# Altium schematic sheet Connector_GTX.SchDoc
size A3
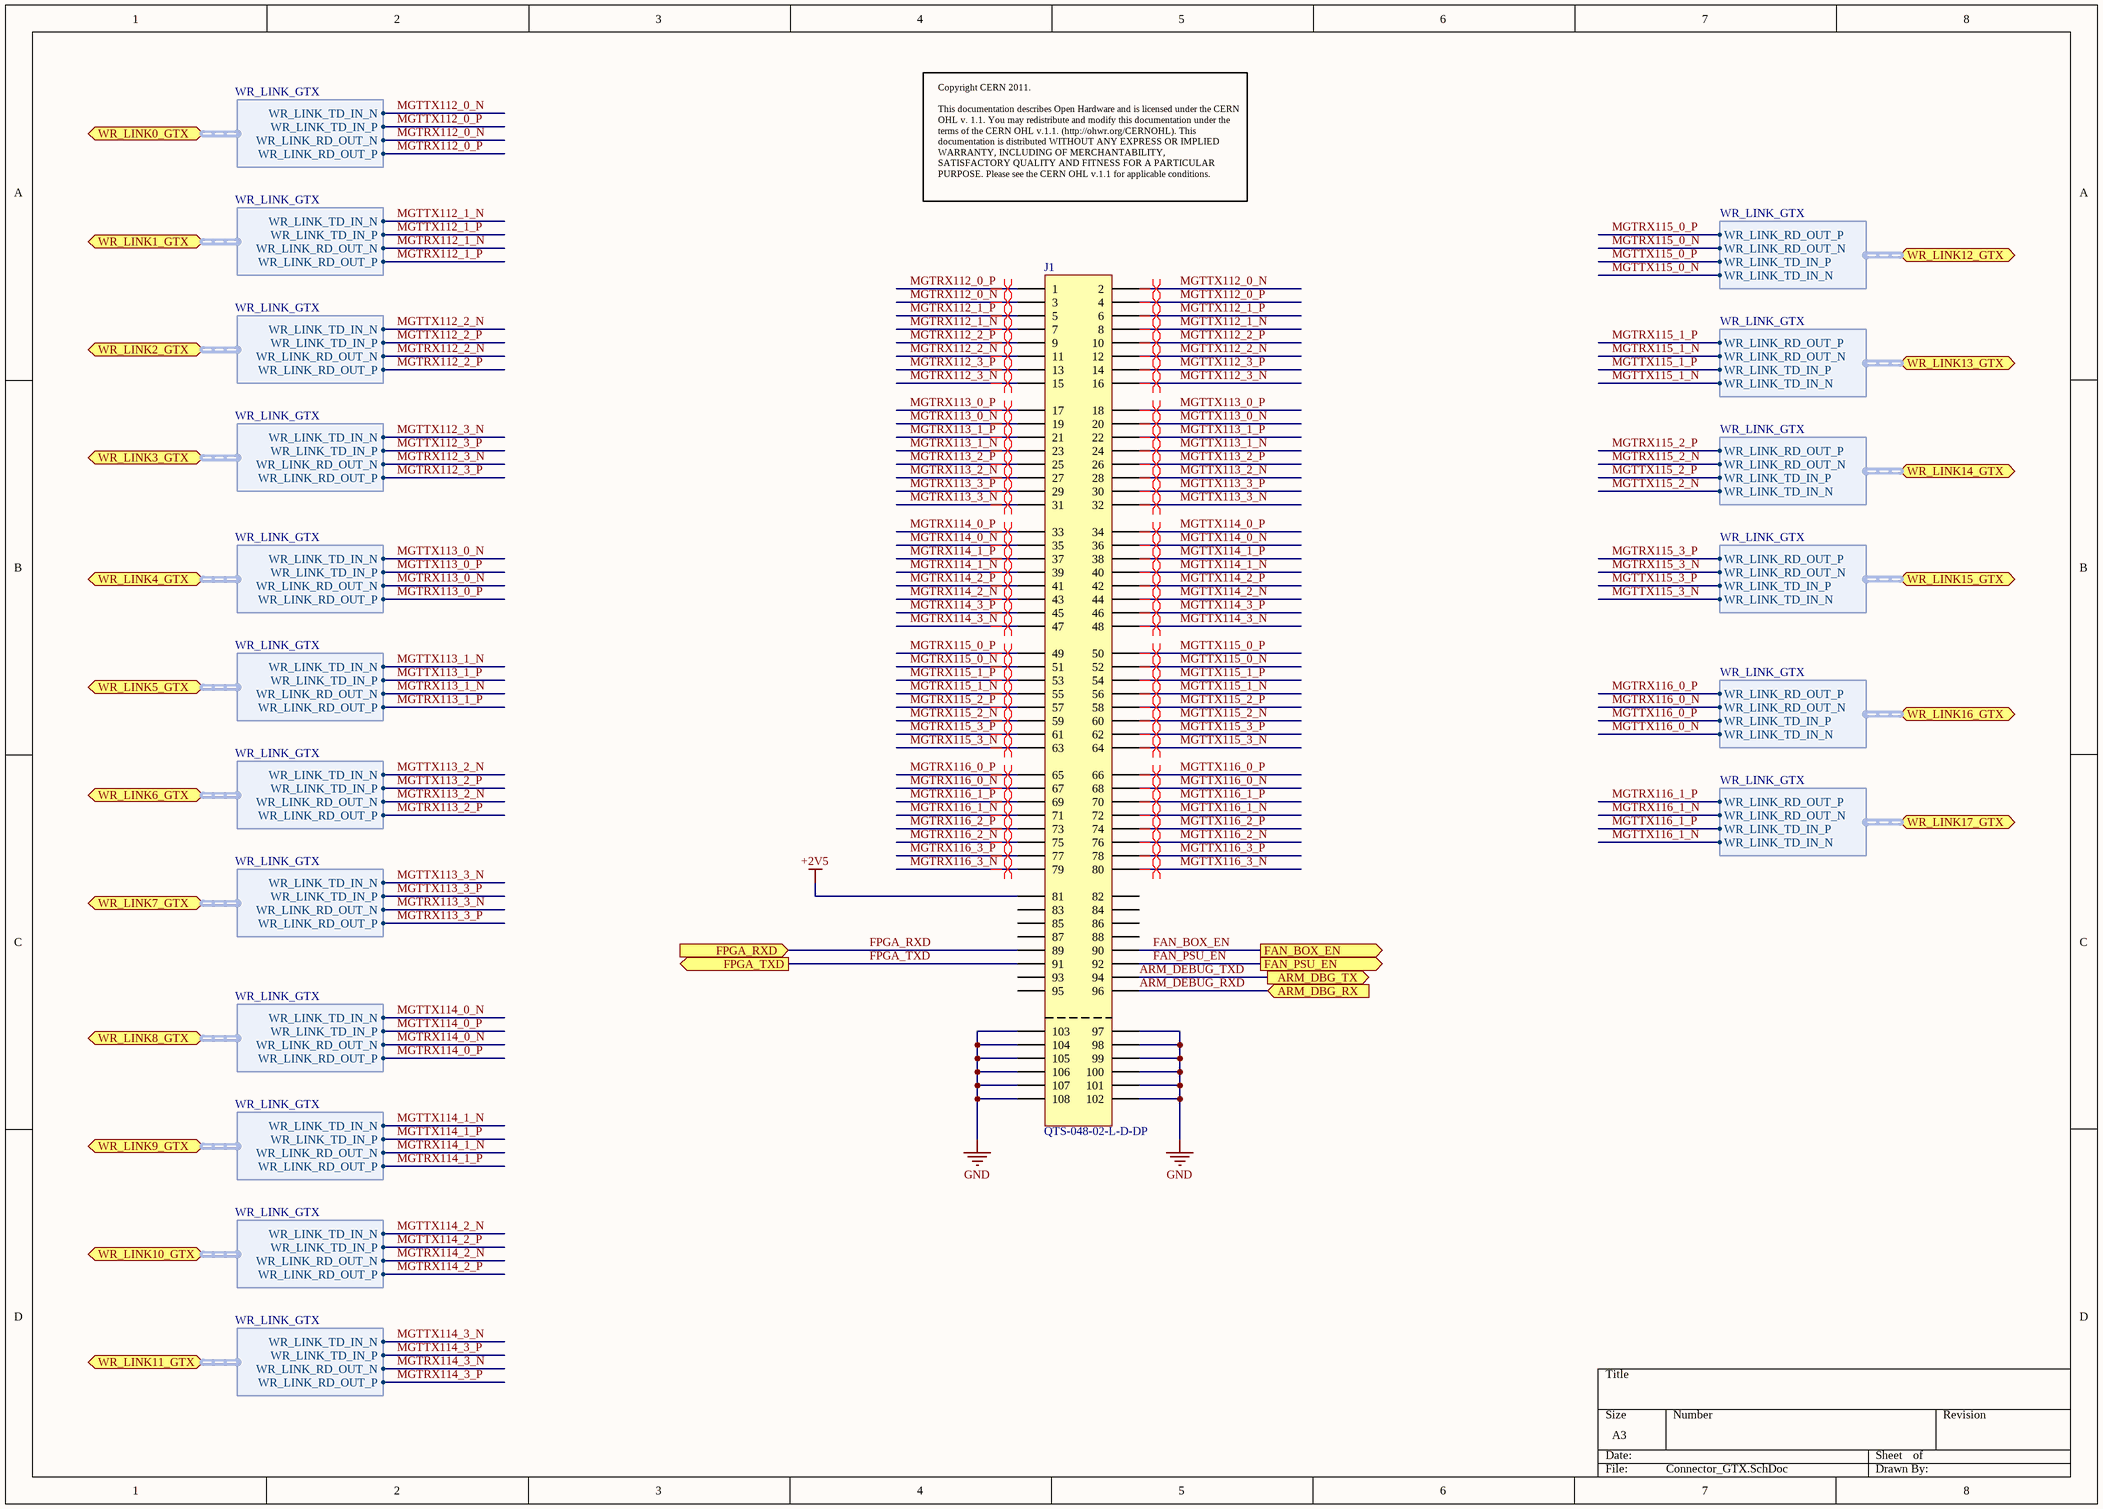
[diagram p0: Connector_GTX.SchDoc]

## Parts
J1  QTS-048-02-L-D-DP  [QTS-048-XX-X-D-DP-A]

## Ports
ARM_DBG_RX (in), ARM_DBG_TX (out), FAN_BOX_EN (out), FAN_PSU_EN (out), FPGA_RXD (in), FPGA_TXD (out), WR_LINK0_GTX (harness WR_LINK_GTX), WR_LINK1_GTX (harness WR_LINK_GTX), WR_LINK2_GTX (harness WR_LINK_GTX), WR_LINK3_GTX (harness WR_LINK_GTX), WR_LINK4_GTX (harness WR_LINK_GTX), WR_LINK5_GTX (harness WR_LINK_GTX), WR_LINK6_GTX (harness WR_LINK_GTX), WR_LINK7_GTX (harness WR_LINK_GTX), WR_LINK8_GTX (harness WR_LINK_GTX), WR_LINK9_GTX (harness WR_LINK_GTX), WR_LINK10_GTX (harness WR_LINK_GTX), WR_LINK11_GTX (harness WR_LINK_GTX), WR_LINK12_GTX (harness WR_LINK_GTX), WR_LINK13_GTX (harness WR_LINK_GTX), WR_LINK14_GTX (harness WR_LINK_GTX), WR_LINK15_GTX (harness WR_LINK_GTX), WR_LINK16_GTX (harness WR_LINK_GTX), WR_LINK17_GTX (harness WR_LINK_GTX)

## Harnesses
WR_LINK_GTX: WR_LINK_TD_IN_N, WR_LINK_TD_IN_P, WR_LINK_RD_OUT_N, WR_LINK_RD_OUT_P

## Nets
+2V5: J1.81
GND: J1.97 J1.98 J1.99 J1.100 J1.101 J1.102 J1.103 J1.104 J1.105 J1.106 J1.107 J1.108
ARM_DEBUG_RXD: J1.96 ; port ARM_DBG_RX
ARM_DEBUG_TXD: J1.94 ; port ARM_DBG_TX
FAN_BOX_EN: J1.90 ; port FAN_BOX_EN
FAN_PSU_EN: J1.92 ; port FAN_PSU_EN
FPGA_RXD: J1.89 ; port FPGA_RXD
FPGA_TXD: J1.91 ; port FPGA_TXD
MGTRX112_0_N: J1.3 ; port WR_LINK0_GTX.WR_LINK_RD_OUT_N
MGTRX112_0_P: J1.1 ; port WR_LINK0_GTX.WR_LINK_RD_OUT_P
MGTRX112_1_N: J1.7 ; port WR_LINK1_GTX.WR_LINK_RD_OUT_N
MGTRX112_1_P: J1.5 ; port WR_LINK1_GTX.WR_LINK_RD_OUT_P
MGTRX112_2_N: J1.11 ; port WR_LINK2_GTX.WR_LINK_RD_OUT_N
MGTRX112_2_P: J1.9 ; port WR_LINK2_GTX.WR_LINK_RD_OUT_P
MGTRX112_3_N: J1.15 ; port WR_LINK3_GTX.WR_LINK_RD_OUT_N
MGTRX112_3_P: J1.13 ; port WR_LINK3_GTX.WR_LINK_RD_OUT_P
MGTRX113_0_N: J1.19 ; port WR_LINK4_GTX.WR_LINK_RD_OUT_N
MGTRX113_0_P: J1.17 ; port WR_LINK4_GTX.WR_LINK_RD_OUT_P
MGTRX113_1_N: J1.23 ; port WR_LINK5_GTX.WR_LINK_RD_OUT_N
MGTRX113_1_P: J1.21 ; port WR_LINK5_GTX.WR_LINK_RD_OUT_P
MGTRX113_2_N: J1.27 ; port WR_LINK6_GTX.WR_LINK_RD_OUT_N
MGTRX113_2_P: J1.25 ; port WR_LINK6_GTX.WR_LINK_RD_OUT_P
MGTRX113_3_N: J1.31 ; port WR_LINK7_GTX.WR_LINK_RD_OUT_N
MGTRX113_3_P: J1.29 ; port WR_LINK7_GTX.WR_LINK_RD_OUT_P
MGTRX114_0_N: J1.35 ; port WR_LINK8_GTX.WR_LINK_RD_OUT_N
MGTRX114_0_P: J1.33 ; port WR_LINK8_GTX.WR_LINK_RD_OUT_P
MGTRX114_1_N: J1.39 ; port WR_LINK9_GTX.WR_LINK_RD_OUT_N
MGTRX114_1_P: J1.37 ; port WR_LINK9_GTX.WR_LINK_RD_OUT_P
MGTRX114_2_N: J1.43 ; port WR_LINK10_GTX.WR_LINK_RD_OUT_N
MGTRX114_2_P: J1.41 ; port WR_LINK10_GTX.WR_LINK_RD_OUT_P
MGTRX114_3_N: J1.47 ; port WR_LINK11_GTX.WR_LINK_RD_OUT_N
MGTRX114_3_P: J1.45 ; port WR_LINK11_GTX.WR_LINK_RD_OUT_P
MGTRX115_0_N: J1.51 ; port WR_LINK12_GTX.WR_LINK_RD_OUT_N
MGTRX115_0_P: J1.49 ; port WR_LINK12_GTX.WR_LINK_RD_OUT_P
MGTRX115_1_N: J1.55 ; port WR_LINK13_GTX.WR_LINK_RD_OUT_N
MGTRX115_1_P: J1.53 ; port WR_LINK13_GTX.WR_LINK_RD_OUT_P
MGTRX115_2_N: J1.59 ; port WR_LINK14_GTX.WR_LINK_RD_OUT_N
MGTRX115_2_P: J1.57 ; port WR_LINK14_GTX.WR_LINK_RD_OUT_P
MGTRX115_3_N: J1.63 ; port WR_LINK15_GTX.WR_LINK_RD_OUT_N
MGTRX115_3_P: J1.61 ; port WR_LINK15_GTX.WR_LINK_RD_OUT_P
MGTRX116_0_N: J1.67 ; port WR_LINK16_GTX.WR_LINK_RD_OUT_N
MGTRX116_0_P: J1.65 ; port WR_LINK16_GTX.WR_LINK_RD_OUT_P
MGTRX116_1_N: J1.71 ; port WR_LINK17_GTX.WR_LINK_RD_OUT_N
MGTRX116_1_P: J1.69 ; port WR_LINK17_GTX.WR_LINK_RD_OUT_P
MGTRX116_2_N: J1.75
MGTRX116_2_P: J1.73
MGTRX116_3_N: J1.79
MGTRX116_3_P: J1.77
MGTTX112_0_N: J1.2 ; port WR_LINK0_GTX.WR_LINK_TD_IN_N
MGTTX112_0_P: J1.4 ; port WR_LINK0_GTX.WR_LINK_TD_IN_P
MGTTX112_1_N: J1.8 ; port WR_LINK1_GTX.WR_LINK_TD_IN_N
MGTTX112_1_P: J1.6 ; port WR_LINK1_GTX.WR_LINK_TD_IN_P
MGTTX112_2_N: J1.12 ; port WR_LINK2_GTX.WR_LINK_TD_IN_N
MGTTX112_2_P: J1.10 ; port WR_LINK2_GTX.WR_LINK_TD_IN_P
MGTTX112_3_N: J1.16 ; port WR_LINK3_GTX.WR_LINK_TD_IN_N
MGTTX112_3_P: J1.14 ; port WR_LINK3_GTX.WR_LINK_TD_IN_P
MGTTX113_0_N: J1.20 ; port WR_LINK4_GTX.WR_LINK_TD_IN_N
MGTTX113_0_P: J1.18 ; port WR_LINK4_GTX.WR_LINK_TD_IN_P
MGTTX113_1_N: J1.24 ; port WR_LINK5_GTX.WR_LINK_TD_IN_N
MGTTX113_1_P: J1.22 ; port WR_LINK5_GTX.WR_LINK_TD_IN_P
MGTTX113_2_N: J1.28 ; port WR_LINK6_GTX.WR_LINK_TD_IN_N
MGTTX113_2_P: J1.26 ; port WR_LINK6_GTX.WR_LINK_TD_IN_P
MGTTX113_3_N: J1.32 ; port WR_LINK7_GTX.WR_LINK_TD_IN_N
MGTTX113_3_P: J1.30 ; port WR_LINK7_GTX.WR_LINK_TD_IN_P
MGTTX114_0_N: J1.36 ; port WR_LINK8_GTX.WR_LINK_TD_IN_N
MGTTX114_0_P: J1.34 ; port WR_LINK8_GTX.WR_LINK_TD_IN_P
MGTTX114_1_N: J1.40 ; port WR_LINK9_GTX.WR_LINK_TD_IN_N
MGTTX114_1_P: J1.38 ; port WR_LINK9_GTX.WR_LINK_TD_IN_P
MGTTX114_2_N: J1.44 ; port WR_LINK10_GTX.WR_LINK_TD_IN_N
MGTTX114_2_P: J1.42 ; port WR_LINK10_GTX.WR_LINK_TD_IN_P
MGTTX114_3_N: J1.48 ; port WR_LINK11_GTX.WR_LINK_TD_IN_N
MGTTX114_3_P: J1.46 ; port WR_LINK11_GTX.WR_LINK_TD_IN_P
MGTTX115_0_N: J1.52 ; port WR_LINK12_GTX.WR_LINK_TD_IN_N
MGTTX115_0_P: J1.50 ; port WR_LINK12_GTX.WR_LINK_TD_IN_P
MGTTX115_1_N: J1.56 ; port WR_LINK13_GTX.WR_LINK_TD_IN_N
MGTTX115_1_P: J1.54 ; port WR_LINK13_GTX.WR_LINK_TD_IN_P
MGTTX115_2_N: J1.60 ; port WR_LINK14_GTX.WR_LINK_TD_IN_N
MGTTX115_2_P: J1.58 ; port WR_LINK14_GTX.WR_LINK_TD_IN_P
MGTTX115_3_N: J1.64 ; port WR_LINK15_GTX.WR_LINK_TD_IN_N
MGTTX115_3_P: J1.62 ; port WR_LINK15_GTX.WR_LINK_TD_IN_P
MGTTX116_0_N: J1.68 ; port WR_LINK16_GTX.WR_LINK_TD_IN_N
MGTTX116_0_P: J1.66 ; port WR_LINK16_GTX.WR_LINK_TD_IN_P
MGTTX116_1_N: J1.72 ; port WR_LINK17_GTX.WR_LINK_TD_IN_N
MGTTX116_1_P: J1.70 ; port WR_LINK17_GTX.WR_LINK_TD_IN_P
MGTTX116_2_N: J1.76
MGTTX116_2_P: J1.74
MGTTX116_3_N: J1.80
MGTTX116_3_P: J1.78

Not connected (* = marked no-connect by the designer): J1 82 83 84 85 86 87 88 93 95

## Layout directives
differential pair: MGTRX112_0_N, MGTRX112_0_P, MGTRX112_1_N, MGTRX112_1_P, MGTRX112_2_N, MGTRX112_2_P, MGTRX112_3_N, MGTRX112_3_P, MGTRX113_0_N, MGTRX113_0_P, MGTRX113_1_N, MGTRX113_1_P, MGTRX113_2_N, MGTRX113_2_P, MGTRX113_3_N, MGTRX113_3_P, MGTRX114_0_N, MGTRX114_0_P, MGTRX114_1_N, MGTRX114_1_P, MGTRX114_2_N, MGTRX114_2_P, MGTRX114_3_N, MGTRX114_3_P, MGTRX115_0_N, MGTRX115_0_P, MGTRX115_1_N, MGTRX115_1_P, MGTRX115_2_N, MGTRX115_2_P, MGTRX115_3_N, MGTRX115_3_P, MGTRX116_0_N, MGTRX116_0_P, MGTRX116_1_N, MGTRX116_1_P, MGTRX116_2_N, MGTRX116_2_P, MGTRX116_3_N, MGTRX116_3_P, MGTTX112_0_N, MGTTX112_0_P, MGTTX112_1_N, MGTTX112_1_P, MGTTX112_2_N, MGTTX112_2_P, MGTTX112_3_N, MGTTX112_3_P, MGTTX113_0_N, MGTTX113_0_P, MGTTX113_1_N, MGTTX113_1_P, MGTTX113_2_N, MGTTX113_2_P, MGTTX113_3_N, MGTTX113_3_P, MGTTX114_0_N, MGTTX114_0_P, MGTTX114_1_N, MGTTX114_1_P, MGTTX114_2_N, MGTTX114_2_P, MGTTX114_3_N, MGTTX114_3_P, MGTTX115_0_N, MGTTX115_0_P, MGTTX115_1_N, MGTTX115_1_P, MGTTX115_2_N, MGTTX115_2_P, MGTTX115_3_N, MGTTX115_3_P, MGTTX116_0_N, MGTTX116_0_P, MGTTX116_1_N, MGTTX116_1_P, MGTTX116_2_N, MGTTX116_2_P, MGTTX116_3_N, MGTTX116_3_P

## Notes on the sheet
- Copyright CERN 2011.
  This documentation describes Open Hardware and is licensed under the CERN OHL v. 1.1. You may redistribute and modify this documentation under the terms of the CERN OHL v.1.1. (http://ohwr.org/CERNOHL). This documentation is distributed WITHOUT ANY EXPRESS OR IMPLIED WARRANTY, INCLUDING OF MERCHANTABILITY, SATISFACTORY QUALITY AND FITNESS FOR A PARTICULAR PURPOSE. Please see the CERN OHL v.1.1 for applicable conditions.

## Library data of the parts
J1 = QTS-048-01-L-D-DP: High Speed Ground Plane Header; Manufacturer1 PN: QTS-048-04-L-D-DP; Manufacturer1: Samtec